# EAGLE design Placa (EAGLE 7.6.0)
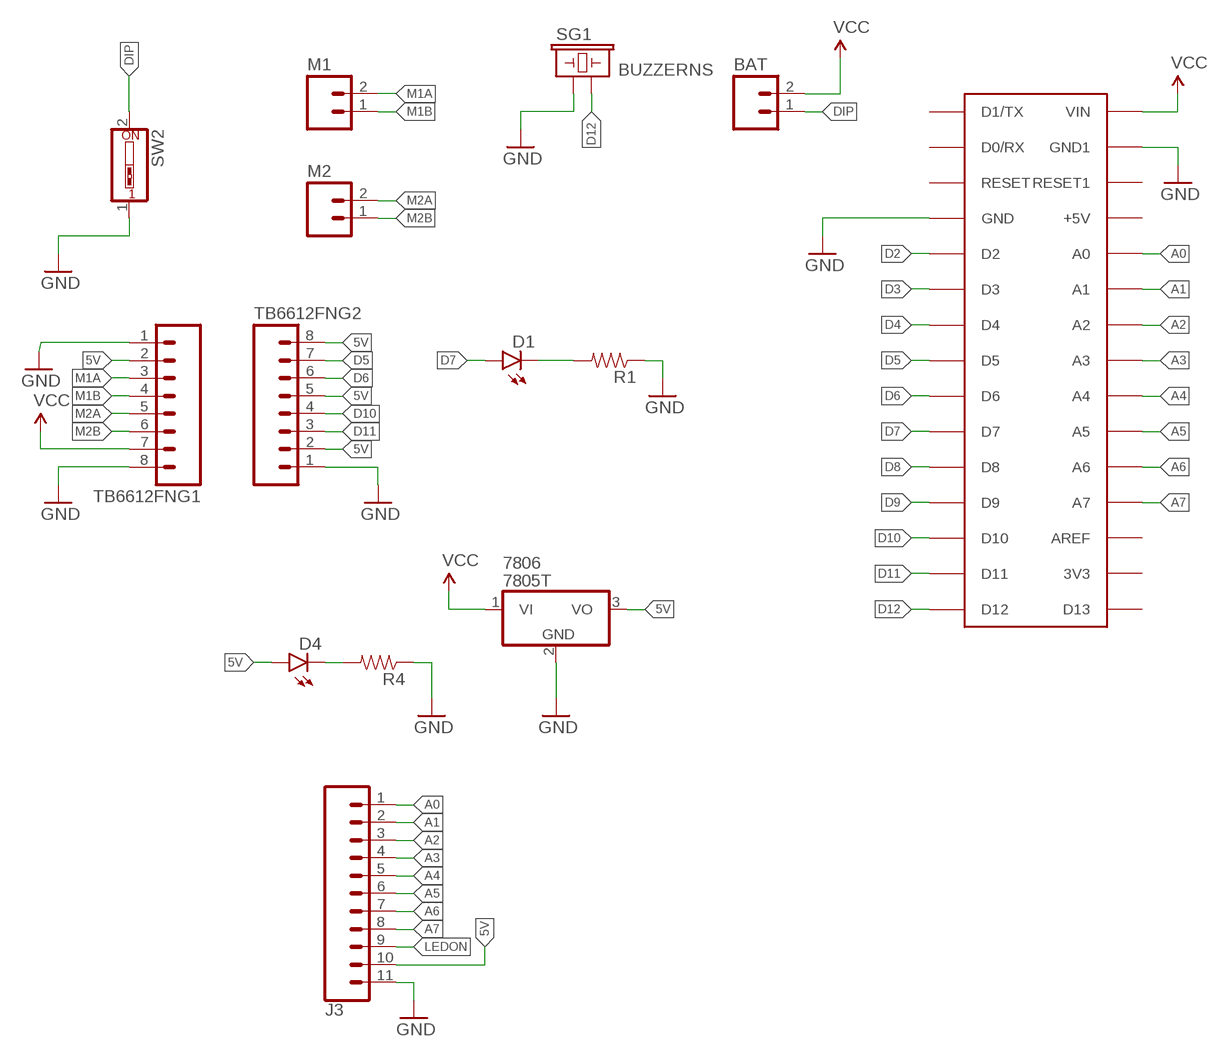
[diagram p0: schematic, sheet 1]

## Parts
7806  7805T  [TO220H]
BAT  M02PTH  [1X02@1]
D1  LED5MM  [LED5MM]
D4  LED5MM  [LED5MM]
J3  CONN_11  [1X11]
M1  M02JST-PTH-VERT  [JST-2-PTH-VERT]
M2  M02JST-PTH-VERT  [JST-2-PTH-VERT]
R1  RESISTOREZ  [AXIAL-0.3EZ]
R4  RESISTOREZ  [AXIAL-0.3EZ]
SG1  BUZZERNS  [BUZZER-12MM-NS]
SW2  SW_DIP-1  [EDG-01]
TB6612FNG1  M08  [1X08_ROUND]
TB6612FNG2  M08  [1X08_ROUND]
U1  NANO  ARDUINONANO  [PDIP-32]

## Nets
5V: 7806.3(VO) D4.A J3.10 TB6612FNG1.2 TB6612FNG2.2 TB6612FNG2.5 TB6612FNG2.8
A0: J3.1 U1.A0
A1: J3.2 U1.A1
A2: J3.3 U1.A2
A3: J3.4 U1.A3
A4: J3.5 U1.A4
A5: J3.6 U1.A5
A6: J3.7 U1.A6
A7: J3.8 U1.A7
D2: U1.D2
D3: U1.D3
D4: U1.D4
D5: TB6612FNG2.7 U1.D5
D6: TB6612FNG2.6 U1.D6
D7: D1.A U1.D7
D8: U1.D8
D9: U1.D9
D10: TB6612FNG2.4 U1.D10
D11: TB6612FNG2.3 U1.D11
D12: SG1.- U1.D12
DIP: BAT.1 SW2.2
GND: 7806.2(GND) J3.11 R1.P$1 R4.P$1 SG1.+ SW2.1 TB6612FNG1.1 TB6612FNG1.8 TB6612FNG2.1 U1.GND U1.GND1
LEDON: J3.9
M1A: M1.2 TB6612FNG1.3
M1B: M1.1 TB6612FNG1.4
M2A: M2.2 TB6612FNG1.5
M2B: M2.1 TB6612FNG1.6
N$2: D4.K(C) R4.P$2
N$4: D1.K(C) R1.P$2
VCC: 7806.1(VI) BAT.2 TB6612FNG1.7 U1.VIN
Unconnected: U1.3V3 U1.+5V U1.AREF U1.D0/RX U1.D1/TX U1.D13 U1.RESET U1.RESET1

## Library data of the parts
7806 = linear:78*: Positive VOLTAGE REGULATOR Source: http://cache.national.com/ds/LM/LM78L05.pdf http://www.fairchildsemi.com/ds/LM/LM7805.pdf
BAT M1 M2 = SparkFun-Connectors:M02: Standard 2-pin 0.1" header. Use with - straight break away headers ( PRT-00116) - right angle break away headers (PRT-00553) - swiss pins (PRT-00743) - machine pins (PRT-00117) - female headers (PRT-00115) Molex polarized connector foot print use with: PRT-08233 with associated crimp pins and housings. 2.54_SCREWTERM for use with PRT-10571. 3.5mm Screw Terminal footprints for PRT-08084 5mm Screw Terminal footprints for use with PRT-08432
D1 D4 = SparkFun-LED:LED: LEDs Standard schematic elements and footprints for 5mm, 3mm, 1206, and 0603 sized LEDs. 5mm - Spark Fun Electronics SKU : COM-00529 (and others)
J3 = SparkFun-Connectors:CONN_11: Multi connection point. Often used as Generic Header-pin footprint for 0.1 inch spaced/style header connections On any of the 0.1 inch spaced packages, you can populate with these: Break Away Headers - Straight <https://www.sparkfun.com/products/116> (PRT-00116) Break Away Male Headers - Right Angle <https://www.sparkfun.com/products/553> (PRT-00553) Female Headers <https://www.sparkfun.com/products/115> (PRT-00115) Break Away Headers - Machine Pin <https://www.sparkfun.com/products/117> (PRT-00117) Break Away Female Headers - Swiss Machine Pin <https://www.sparkfun.com/products/743> (PRT-00743) For SCREWTERMINALS and SPRING TERMINALS visit here: Screw Terimnals on SparkFun.com <https://www.sparkfun.com/search/results?term=Screw+Terminals> (5mm/3.5mm/2.54mm spacing) This device is also useful as a general connection point to wire up your design to another part of your project. Our various solder wires solder well into these plated through hole pads. Hook-Up Wire - Assortment (Stranded, 22 AWG) <https://www.sparkfun.com/products/11375> (PRT-11375) Hook-Up Wire - Assortment (Solid Core, 22 AWG) <https://www.sparkfun.com/products/11367> (PRT-11367) View the entire wire category on our website here <https://www.sparkfun.com/categories/141>
R1 R4 = SparkFun-Resistors:RESISTOR: Resistor Basic schematic elements and footprints for 0603, 1206, and PTH resistors.
SG1 = SparkFun-Electromechanical:BUZZER: Buzzer 12mm Spark Fun Electronics SKU : Comp-Buzzer
SW2 = special:SW_DIP-1: DIP SWITCH
TB6612FNG1 TB6612FNG2 = SparkFun-Connectors:M08: Header 8 Standard 8-pin 0.1" header. Use with straight break away headers (SKU : PRT-00116), right angle break away headers (PRT-00553), swiss pins (PRT-00743), machine pins (PRT-00117), and female headers (PRT-00115).; PROD_ID: CONN-08437
U1 = jet-lib:ARDUINONANO

## Board
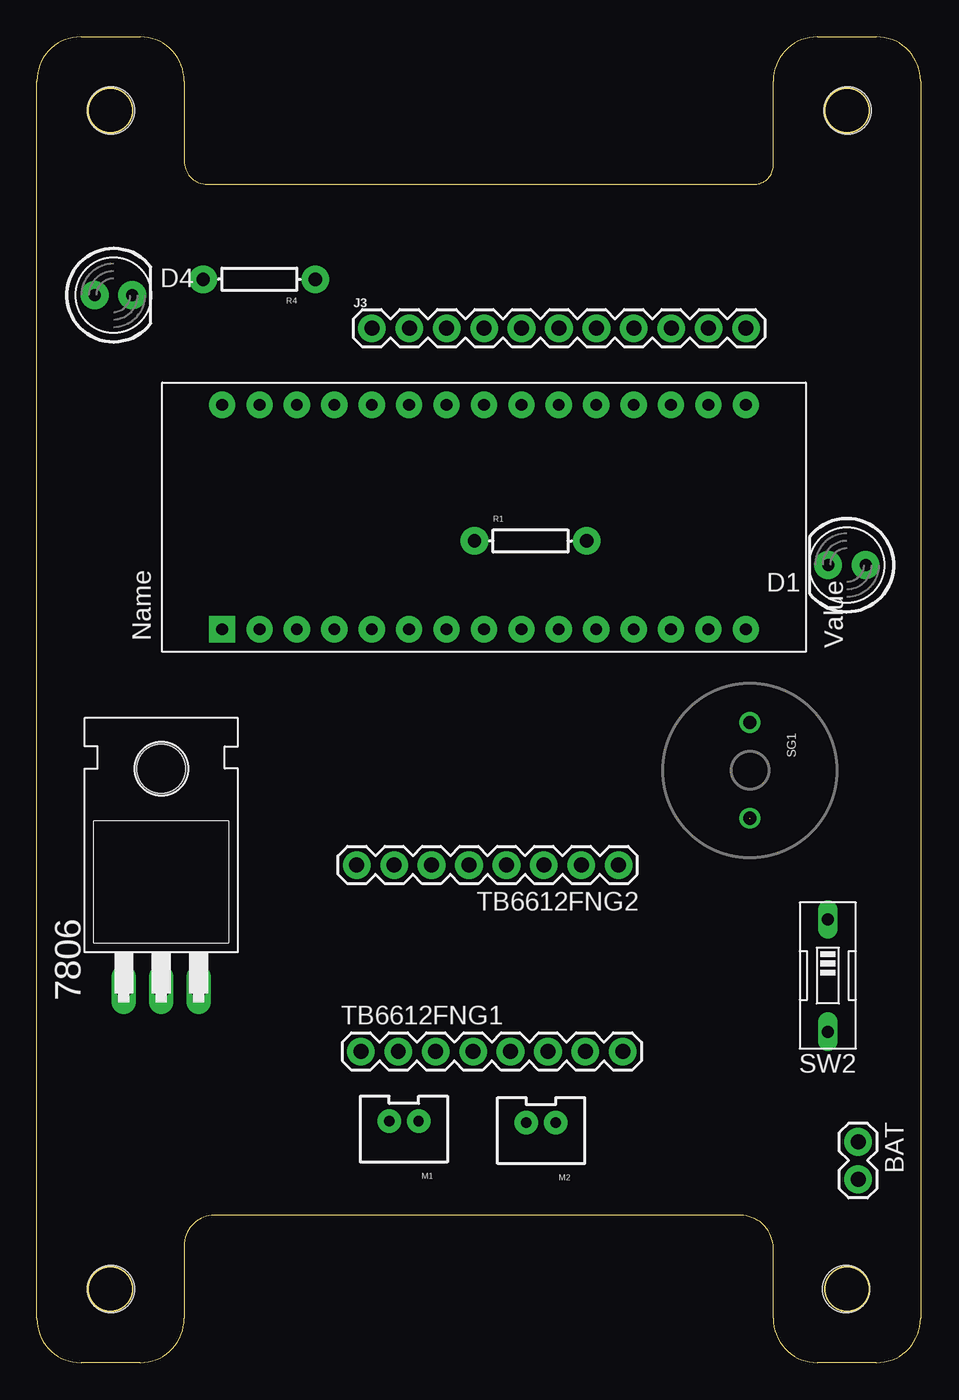
[diagram p1: board, top side]
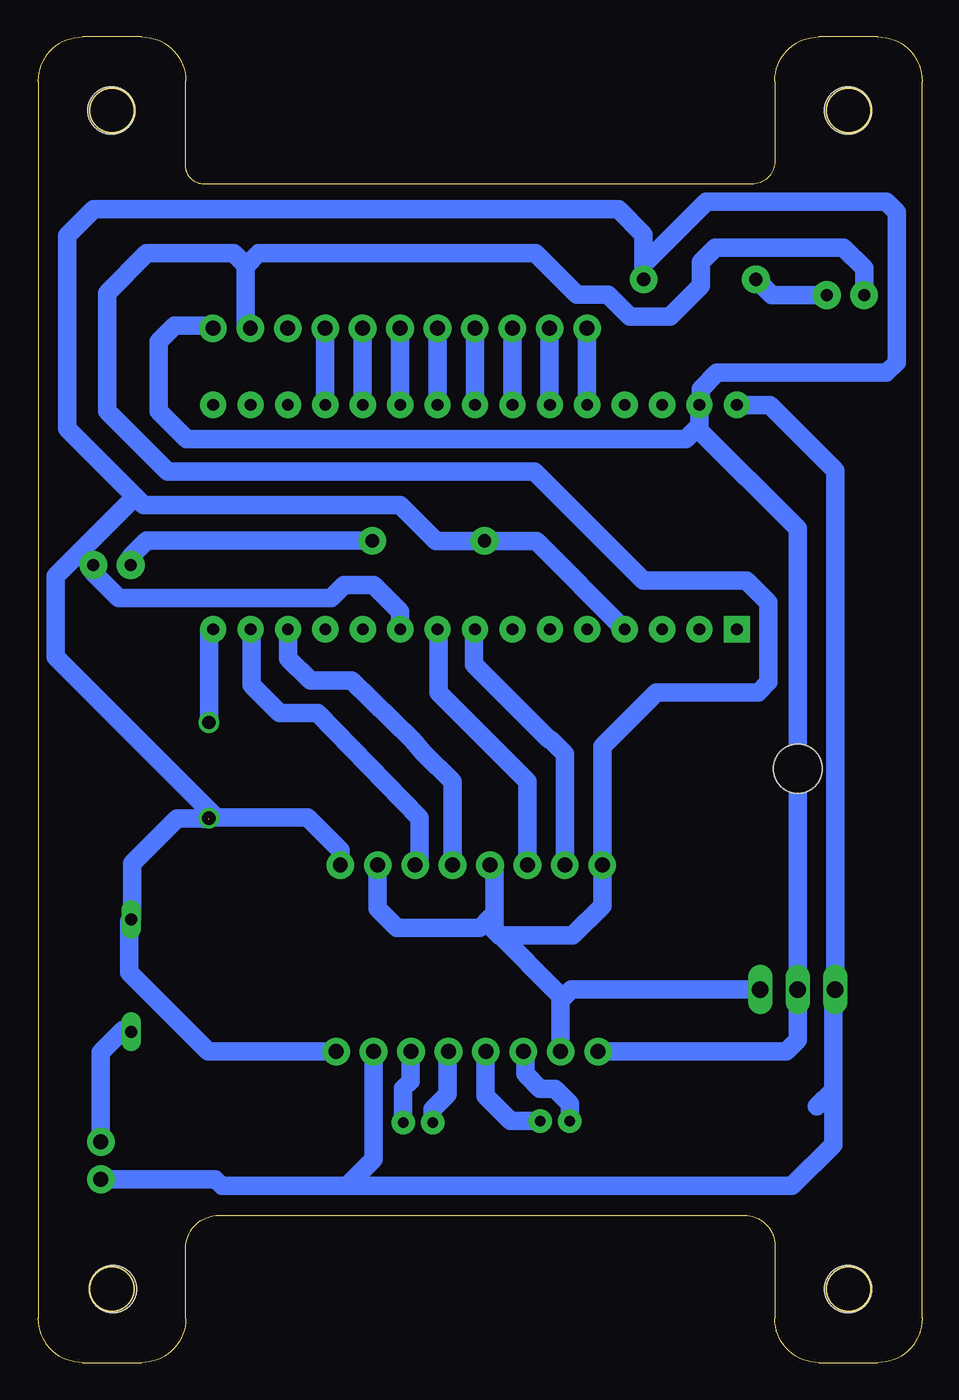
[diagram p2: board, bottom side, seen from below]

Size 60 x 90 mm. Coordinates in mm from the lower left corner, seen from the top.
Outline: 53,90 57,90 arc-90 60,87 60,3 arc-90 57,0 53,0 arc-90 50,3 50,7.75 arc90 47.75,10 12.06,10 arc90 10,7.94 10,3 arc-90 7,0 3,0 arc-90 0,3 0,87 arc-90 3,90 7,90 arc-90 10,87 10,81.57 arc90 11.57,80 48.75,80 arc90 50,81.25 50,87 arc-90 53,90
Outline: circle at 5,85 radius 1.5
Outline: circle at 55,5 radius 1.5
Outline: circle at 55,85 radius 1.5
Outline: circle at 5,5 radius 1.5
Copper layers (1*16): Top 0.035mm / dielectric 1.5mm / Bottom 0.035mm
Design rules "default *": minimum track width 10mil, minimum drill 0.9mm, track to track 8mil, track to pad 8mil, pad to pad 8mil, via to via 8mil, smd to smd 8mil, copper to edge 0mil, drill to drill 8mil, minimum pad ring 10mil, minimum via ring 8mil, stop-mask expansion 4mil, vias tented up to drill 0mil, thermal gap 10mil
Holes 3.2 mm at 5.04,85 55.04,85 54.94,5 5.04,5

### Footprints (pad centres in the part's own frame; a part is rotated, then mirrored left to right if it is on the bottom)
TO220H = drill 1.118 long: 1 -2.54,-10.16; 2 0,-10.16; 3 2.54,-10.16 | hole 3.302: 0,4.826
1X02@1 = drill 1.016 pad 1.88: 1 0,0; 2 2.54,0
LED5MM = drill 0.813 pad 1.88: A -1.27,0; K 1.27,0
1X11 = drill 1.016 pad 1.88: 1 0,0; 2 2.54,0; 3 5.08,0; 4 7.62,0; 5 10.16,0; 6 12.7,0; 7 15.24,0; 8 17.78,0; 9 20.32,0; 10 22.86,0; 11 25.4,0
JST-2-PTH-VERT = drill 0.7 pad 1.6: 1 -1,-0.55; 2 1,-0.55
AXIAL-0.3EZ = drill 0.9 pad 1.88: P$1 -3.81,0; P$2 3.81,0
BUZZER-12MM-NS = drill 0.9: + 3.25,0; - -3.25,0
EDG-01 = drill 0.813 long: 1 0,-3.81; 2 0,3.81
1X08_ROUND = drill 1.016 pad 1.88: 1 0,0; 2 2.54,0; 3 5.08,0; 4 7.62,0; 5 10.16,0; 6 12.7,0; 7 15.24,0; 8 17.78,0
PDIP-32 = drill 0.8 pad 1.778: 3V3 15.24,-35.56; +5V 15.24,-10.16; A0 15.24,-12.7; A1 15.24,-15.24; A2 15.24,-17.78; A3 15.24,-20.32; A4 15.24,-22.86; A5 15.24,-25.4; A6 15.24,-27.94; A7 15.24,-30.48; AREF 15.24,-33.02; D0/RX 0,-5.08; D2 0,-12.7; D3 0,-15.24; D4 0,-17.78; D5 0,-20.32; D6 0,-22.86; D7 0,-25.4; D8 0,-27.94; D9 0,-30.48; D10 0,-33.02; D11 0,-35.56; D12 0,-38.1; D13 15.24,-38.1; GND 0,-10.16; GND1 15.24,-5.08; RESET 0,-7.62; RESET1 15.24,-7.62; VIN 15.24,-2.54 | drill 0.8 pad 1.778 square: D1/TX 0,-2.54

### Placement (x,y rotation side)
7806  8.45,35.49 0 top
BAT  55.76,14.99 270 top
D1  55,54.14 180 top
D4  5.2,72.46 0 top
J3  22.75,70.21 0 top
M1  24.92,15.85 180 top
M2  34.23,15.75 180 top
R1  33.52,55.78 0 top
R4  15.1,73.54 180 top
SG1  48.42,40.21 270 top
SW2  53.7,26.28 180 top
TB6612FNG1  22,21.12 0 top
TB6612FNG2  39.5,33.78 180 top
U1  10.04,49.78 90 top

### Tracks (layer width: path | path; a pad name or v marks a point on that pad's centre or on a via)
5V
  Bottom 1.27: 45.94,74.4 45.94,74.5 46.74,75.3 52.64,75.3 55.34,72.6 55.34,64.6 51.24,60.5 26.34,60.5 18.94,53.1 11.94,53.1 10.44,51.6 10.44,46.2 11.14,45.5 18.04,45.5 21.72,41.82 TB6612FNG2.8 21.72,31.02 23.74,29 28.74,29 29.64,29.9 | 45.94,74.4 45.94,70.54 J3.10 | 45.94,74.4 45.04,75.3 26.24,75.3 23.44,72.5 21.34,72.5 19.84,71 17.14,71 15.04,73.1 15.04,74.7 14.04,75.7 5.34,75.7 3.93,74.3 D4.A | TB6612FNG1.2 24.54,24.6 | 24.54,24.6 24.54,24.9 29.04,29.4 29.04,30.5 | 29.04,30.5 29.04,33.47 TB6612FNG2.5 | 7806.3 23.81,25.33 24.54,24.6 | TB6612FNG2.2 36.96,30.82 35.64,29.5 30.04,29.5 29.64,29.9 | 29.64,29.9 29.04,30.5
A0
  Bottom 1.27: J3.1 22.75,65.03 U1.A0
A1
  Bottom 1.27: J3.2 25.29,65.03 U1.A1
A2
  Bottom 1.27: J3.3 27.83,65.03 U1.A2
A3
  Bottom 1.27: J3.4 30.37,65.03 U1.A3
A4
  Bottom 1.27: J3.5 32.91,65.03 U1.A4
A5
  Bottom 1.27: J3.6 35.45,65.03 U1.A5
A6
  Bottom 1.27: J3.7 37.99,65.03 U1.A6
A7
  Bottom 1.27: J3.8 40.53,65.03 U1.A7
D5
  Bottom 1.27: TB6612FNG2.7 24.26,41.32 25.24,42.3 25.34,42.3 30.44,47.4 30.44,49.7 U1.D5
D6
  Bottom 1.27: TB6612FNG2.6 26.8,39.46 32.84,45.5 32.84,49.72 U1.D6
D7
  Bottom 1.27: U1.D7 35.44,51 37.24,52.8 39.24,52.8 40.14,51.9 54.54,51.9 56.27,53.63 D1.A
D10
  Bottom 1.27: TB6612FNG2.4 31.88,39.44 33.84,41.4 34.64,42.3 38.74,46.3 41.54,46.3 43.04,47.8 43.04,49.76 U1.D10
D11
  Bottom 1.27: 45.64,49.74 U1.D11 45.54,49.72 45.54,46 43.64,44.1 41.04,44.1 34.12,36.98 34.12,34.08 TB6612FNG2.3
D12
  Bottom 1.27: SG1.- 48.42,49.5 U1.D12
DIP
  Bottom 1.27: BAT.1 55.76,21.08 54.24,22.6 53.83,22.6 SW2.2
GND  (1 unrouted)
  Bottom 1.27: SG1.+ 50.58,36.96 53.64,33.9 53.64,30.15 SW2.1 53.84,29.95 53.84,26.5 48.46,21.12 TB6612FNG1.8 | TB6612FNG2.1 39.5,34.76 41.74,37 47.94,37 | 47.94,37 48.64,37 48.74,36.9 48.44,36.9 | U1.GND1 15.12,63.62 15.29,63.45 | 15.29,63.45 16.04,62.7 49.94,62.7 51.84,64.6 51.84,69.3 50.74,70.4 48.33,70.4 J3.11 | 53.44,58.8 52.84,58.2 35.44,58.2 33.02,55.78 R1.P$1 26.2,55.78 U1.GND | 53.44,58.8 58.04,63.4 58.04,76.5 56.24,78.3 20.64,78.3 18.91,76.58 18.91,74.52 | 15.03,65.1 U1.GND1 | 47.94,37 58.84,47.9 58.84,53.4 53.44,58.8 | 15.29,63.45 8.45,56.61 7806.2 8.44,21.9 9.21,21.12 TB6612FNG1.1 | R4.P$1 18.91,74.52 | 18.91,74.52 14.64,78.8 2.44,78.8 1.74,78.1 1.74,67.9 2.44,67.2 13.94,67.2 15.04,66.1 15.04,65.1 U1.GND1
M1A
  Bottom 1.27: M1.2 23.92,17.58 24.94,18.6 25.94,18.6 26.94,19.6 26.94,20.98 TB6612FNG1.3
M1B
  Bottom 1.27: M1.1 27.94,16.4 29.64,18.1 29.64,21.11 TB6612FNG1.4
M2A
  Bottom 1.27: M2.2 33.23,17.21 32.24,18.2 32.24,21.05 TB6612FNG1.5
M2B
  Bottom 1.27: M2.1 35.23,18.61 34.74,19.1 34.74,21.09 TB6612FNG1.6
N$2
  Bottom 1.27: D4.K 10.22,72.46 R4.P$2
N$4
  Bottom 1.27: D1.K 53.73,54.71 52.64,55.8 37.35,55.8 R1.P$2
VCC
  Bottom 1.27: BAT.2 47.98,12.45 47.54,12 39.04,12 | 39.04,12 8.84,12 6.04,14.8 6.04,18.5 | 6.04,18.5 6.04,25.2 7806.1 5.91,60.57 10.34,65 12.56,65 U1.VIN | 7.14,17.4 6.04,18.5 | TB6612FNG1.7 37.24,13.8 39.04,12